# Altium schematic sheet Power.SchDoc
size A4
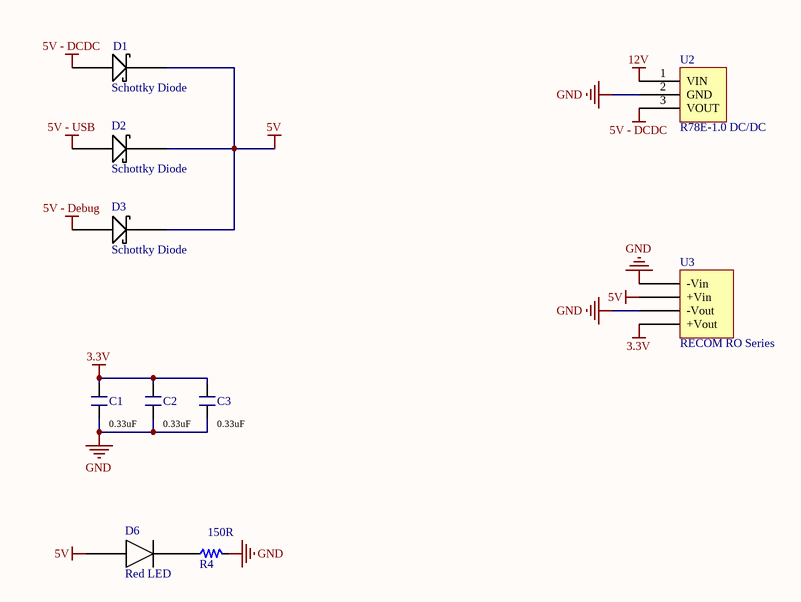
[diagram p0: Power.SchDoc]

## Parts
C1  Capacitance: 0.33uF  [PCB_GENERIC_SMD_0603]  (hidden comment: SCH_GENERIC_CAPACITOR_0603)
C2  Capacitance: 0.33uF  [PCB_GENERIC_SMD_0603]  (hidden comment: SCH_GENERIC_CAPACITOR_0603)
C3  Capacitance: 0.33uF  [PCB_GENERIC_SMD_0603]  (hidden comment: SCH_GENERIC_CAPACITOR_0603)
D1  Schottky Diode  [ON Semi Schottky Diode - MBRM110LT1G]
D2  Schottky Diode  [ON Semi Schottky Diode - MBRM110LT1G]
D3  Schottky Diode  [ON Semi Schottky Diode - MBRM110LT1G]
D6  Red LED  [SMD_0603_LED]
R4  Resistance: 150R  [PCB_GENERIC_SMD_0603]  (hidden comment: SCH_GENERIC_RESISTOR_0603)
U2  R78E-1.0 DC/DC  [R78-1.0]
U3  RECOM RO Series  [RECOM RO Series 1W DCDC]

## Nets
3.3V: C1.2 C2.2 C3.2 U3.4(+Vout)
5V: D1.1 D2.1 D3.1 D6.1 U3.2(+Vin)
5V - DCDC: D1.2 U2.3(VOUT)
5V - Debug: D3.2
5V - USB: D2.2
12V: U2.1(VIN)
GND: C1.1 C2.1 C3.1 R4.2 U2.2(GND) U3.1(-Vin) U3.3(-Vout)
NetD6_2: D6.2 R4.1

## Library data of the parts
C1 = SCH_GENERIC_CAPACITOR_0603: Generic SMD capacitor 0603
C2 C3 = SCH_GENERIC_CAPACITOR_0603: Generic SMD capacitor 0603; Tolerance: *%
D1-D3 = ON Semi Schottky Diode - MBRM110LT1G
D6 = SMD_0603_LED
R4 = SCH_GENERIC_RESISTOR_0603: Generic SMD resistor 0603
U2 = R78E-1.0
U3 = RECOM RO Series DCDC Converter